# EasyEDA Pro project ProDoc_cyrus.epro, board PCB2
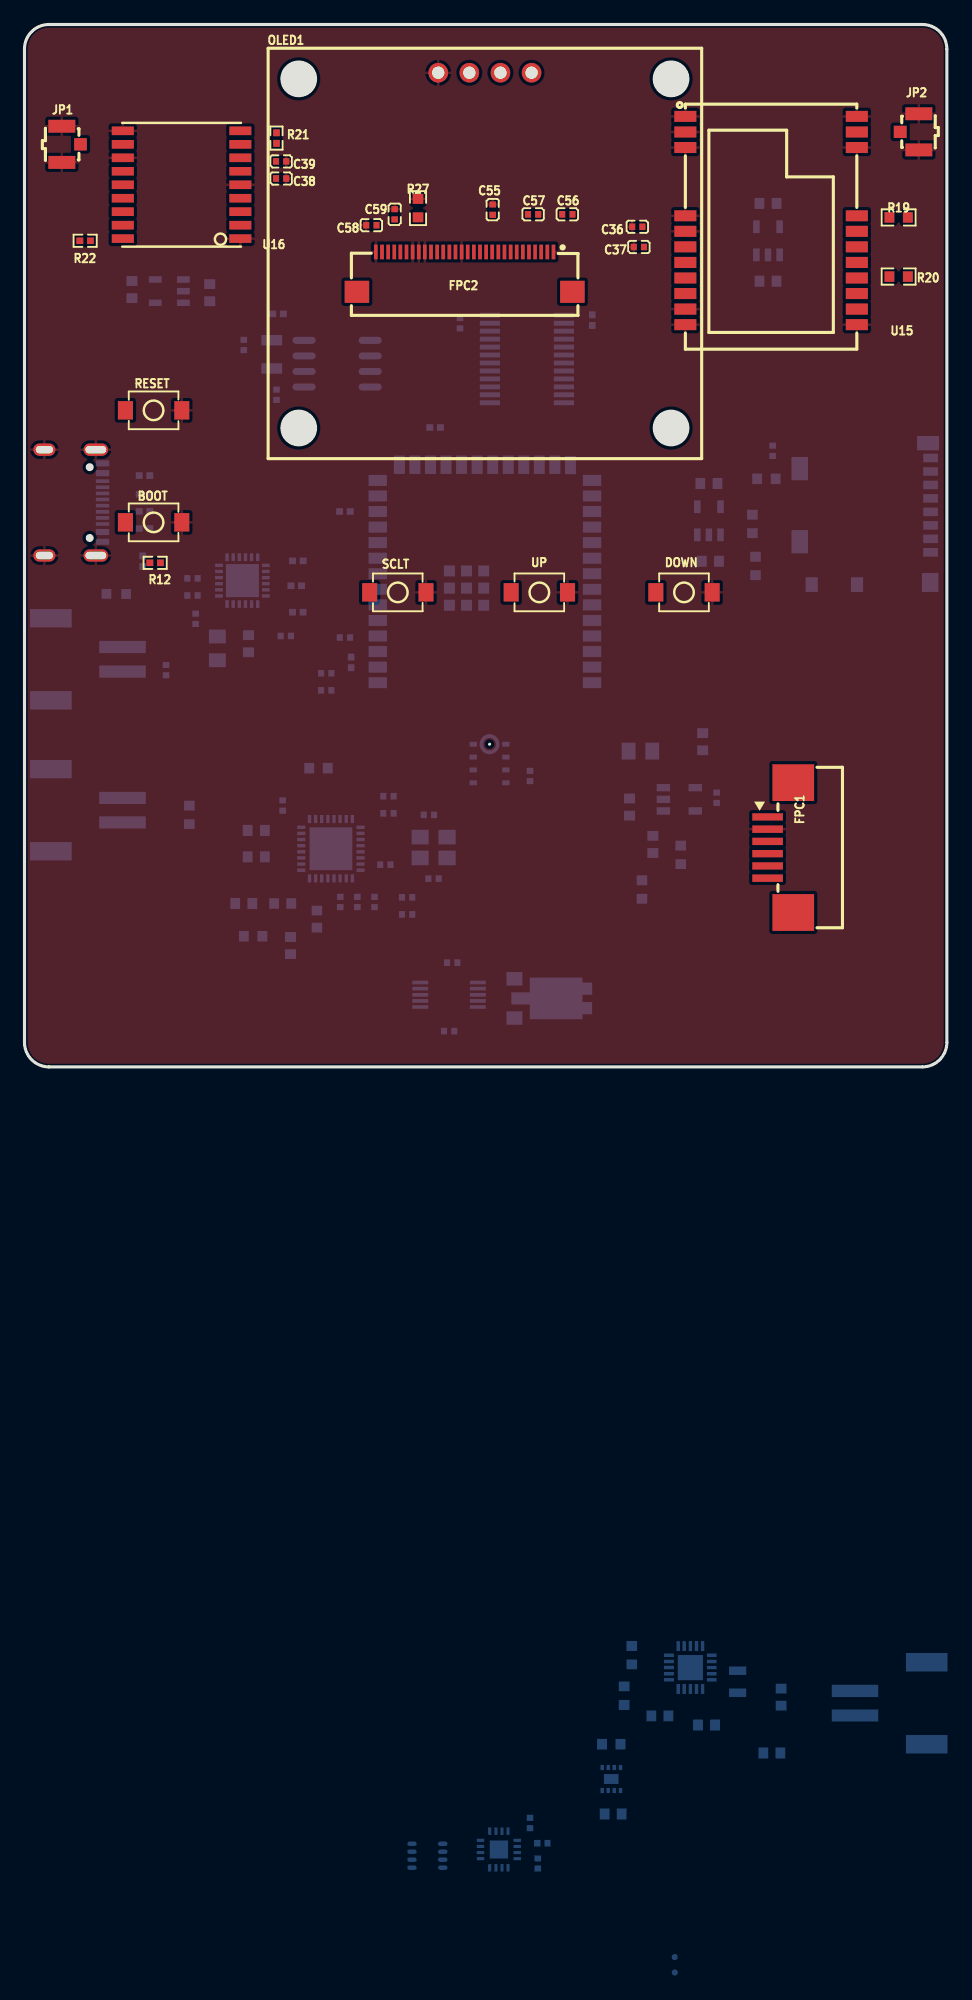
[diagram p5: board, top side]
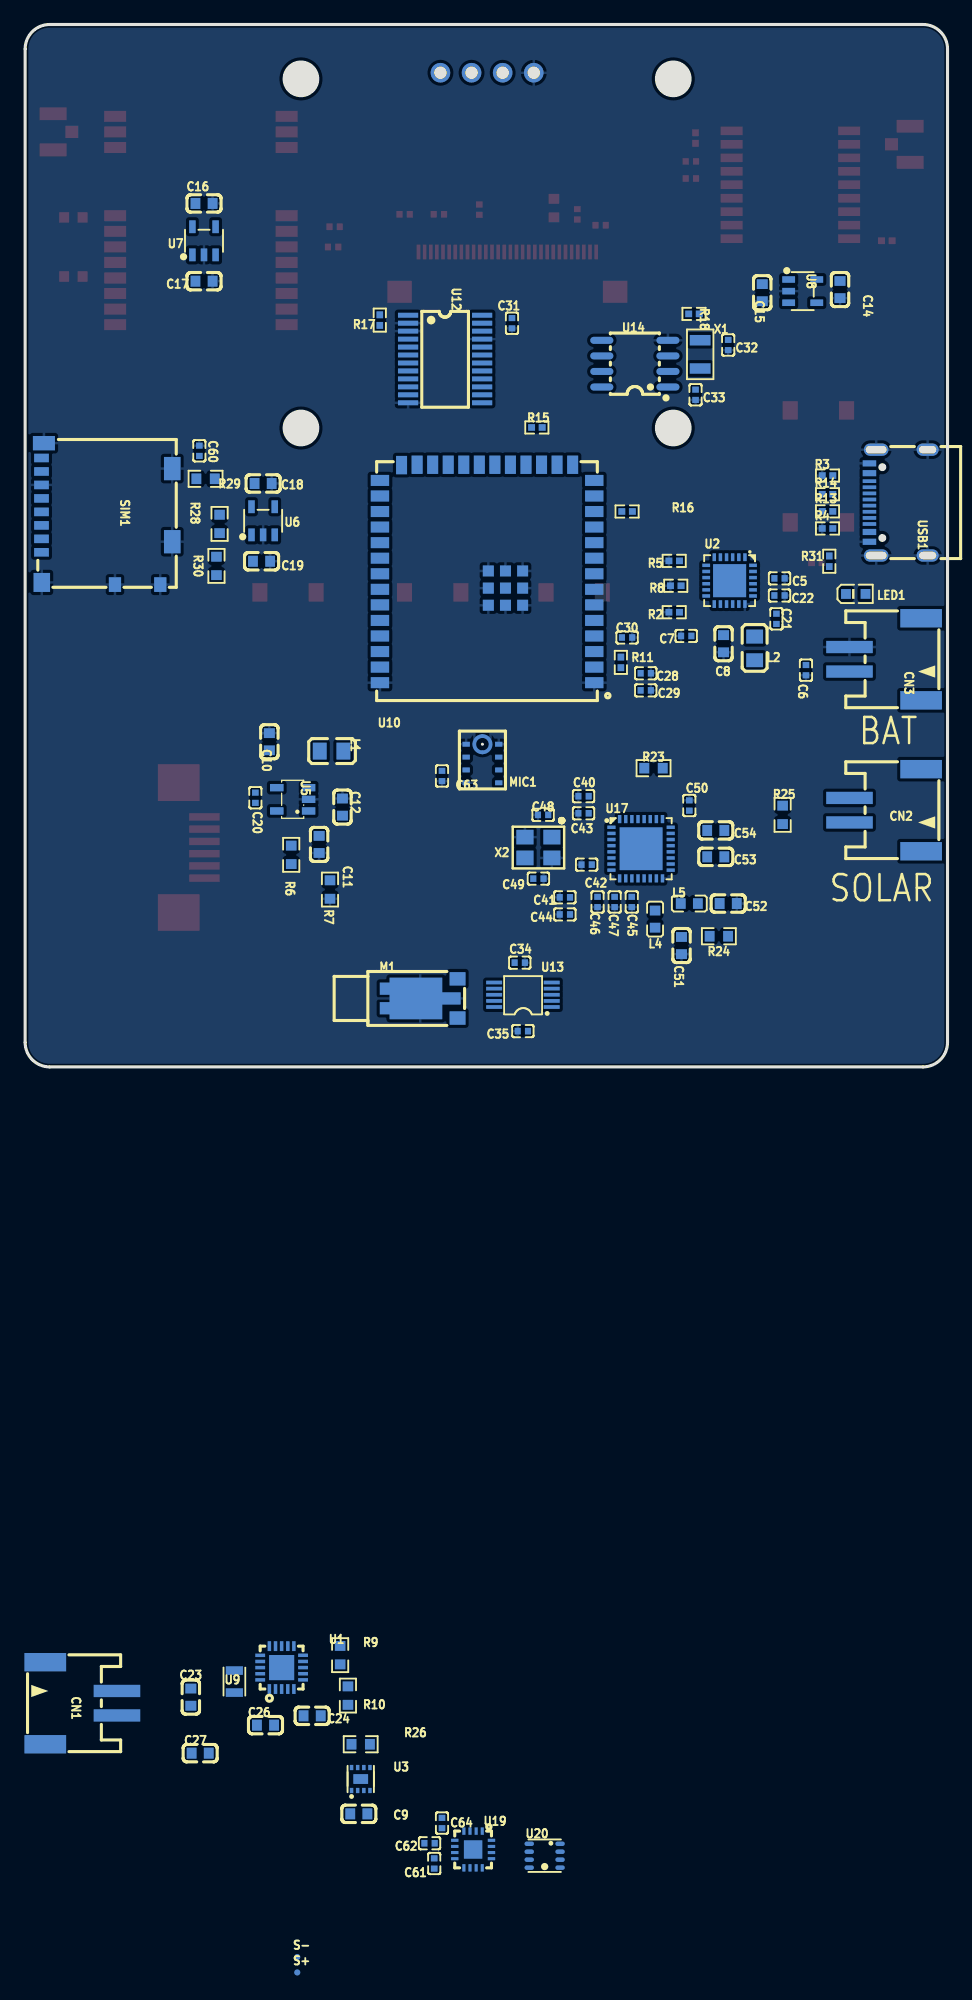
[diagram p6: board, bottom side, seen from below]

Outline 75.31 x 85.09 mm; copper layers: Top Layer, GND, VDD3V3, Bottom Layer. Coordinates in mm from the lower left corner of the outline.
Outline path: 0,83.09 0,2 arc(0.59,0.59) 2,0 73.31,0 arc(74.73,0.59) 75.31,2 75.31,83.09 arc(74.73,84.5) 73.31,85.09 2,85.09 arc(0.59,84.5) 0,83.09
Stack: Top Layer 0.035mm Outer layer thickness 1oz / Dielectric1 0.2104mm 7628 RC49% 8.6mil / GND 0.0152mm Inner layer thickness / Dielectric2 1.065mm 1.1mm H/HOZ Copper / VDD3V3 0.0152mm Inner layer thickness / Dielectric3 0.2104mm 7628 RC49% 8.6mil / Bottom Layer 0.035mm Outer layer thickness 1oz

## Design rules (mm)
net USB_DN: DP1
net USB_DP: DP1
template: JLCPCB Capability(Two Layers Board)
spacing copperThickness1oz (default): track to track 0.102, other pairs 0.152 to 0.3
spacing copperThickness2oz: track to track 0.203, other pairs 0.152 to 0.3
track width copperThickness1oz (default): min 0.127, default 0.254, max 2.54
track width copperThickness2oz: min 0.203, default 0.254, max 2.54
differential pair differentialPair (default): width min 0.127, default 0.254, max 2.54; gap min 0.152, default 0.152
via viaSize (default): diameter min 0.5, default 0.61, max 10; hole min 0.3, default 0.305, max 6.3

## Placement (name value [footprint] x y rotation side)
BOOT  TS-1088-AR02016  [SW-SMD_L3.9-W2.9-LS4.8]  10.54 44.45 0 top
C5  10uF  [C0402]  13.72 39.88 180 bottom
C6  10uF  [C0402]  11.56 32.39 270 bottom
C7  10uF  [C0402]  21.34 35.18 180 bottom
C8  22uF  [C0603]  18.29 34.54 270 bottom
C9  100nF  [C0603]  48.07 -60.97 0 bottom
C10  10uF  [C0603]  55.37 26.54 270 bottom
C11  100nF  [C0603]  51.31 18.16 90 bottom
C12  22uF  [C0603]  49.4 21.21 270 bottom
C14  10uF  [C0603]  8.78 63.45 270 bottom
C15  100nF  [C0603]  15.13 63.2 270 bottom
C16  10uF  [C0603]  60.71 70.49 180 bottom
C17  100nF  [C0603]  60.71 64.14 180 bottom
C18  10uF  [C0603]  55.88 47.63 180 bottom
C19  100nF  [C0603]  56.01 41.28 180 bottom
C20  22pF  [C0402]  56.52 21.97 90 bottom
C21  47nF  [C0402]  13.97 36.58 90 bottom
C22  10uF  [C0402]  13.72 38.48 180 bottom
C23  4.7uF  [C0603]  61.78 -51.45 90 bottom
C24  10nF  [C0603]  51.88 -52.97 0 bottom
C26  4.7uF  [C0603]  55.69 -53.73 0 bottom
C27  100nF  [C0603]  61.02 -56.02 0 bottom
C28  100nF  [C0402]  24.64 32.13 180 bottom
C29  10uF  [C0402]  24.64 30.73 180 bottom
C30  1uF  [C0402]  26.16 35.05 0 bottom
C31  100nF  [C0402]  35.56 60.71 270 bottom
C32  12pF  [C0402]  17.91 58.93 90 bottom
C33  12pF  [C0402]  20.57 54.86 90 bottom
C34  100nF  [C0402]  34.92 8.51 180 bottom
C35  1uF  [C0402]  34.67 2.92 180 bottom
C36  10uF  [C0402]  50.04 68.58 180 top
C37  100nF  [C0402]  50.17 66.93 180 top
C38  10uF  [C0402]  20.95 72.52 180 top
C39  100nF  [C0402]  20.95 73.91 0 top
C40  100nF  [C0402]  29.72 22.1 180 bottom
C41  100nF  [C0402]  31.24 13.84 180 bottom
C42  100nF  [C0402]  29.46 16.51 180 bottom
C43  100nF  [C0402]  29.72 20.7 180 bottom
C44  100nF  [C0402]  31.24 12.45 180 bottom
C45  100nF  [C0402]  25.78 13.46 90 bottom
C46  100nF  [C0402]  28.58 13.46 90 bottom
C47  100nF  [C0402]  27.18 13.46 90 bottom
C48  10pF  [C0402]  33.02 20.57 0 bottom
C49  10pF  [C0402]  33.4 15.37 0 bottom
C50  1uF  [C0402]  21.08 21.34 90 bottom
C51  100pF  [C0603]  21.72 9.91 270 bottom
C52  100pF  [C0603]  17.91 13.34 180 bottom
C53  1nF  [C0603]  18.92 17.15 0 bottom
C54  1nF  [C0603]  18.92 19.3 0 bottom
C55  100nF  [C0402]  38.23 69.98 270 top
C56  1uF  [C0402]  44.32 69.6 0 top
C57  1uF  [C0402]  41.53 69.6 0 top
C58  4.7uF  [C0402]  28.32 68.71 0 top
C59  4.7uF  [C0402]  30.23 69.6 270 top
C60  100nF  [C0402]  61.09 50.29 270 bottom
C61  10uF  [C0402]  41.91 -65.02 90 bottom
C62  100nF  [C0402]  42.29 -63.37 180 bottom
C63  100nF  [C0402]  41.27 23.75 270 bottom
C64  100nF  [C0402]  41.27 -61.72 270 bottom
CN1  S2B-PH-SM4-TB(LF)(SN)  [CONN-SMD_P2.00_S2B-PH-SM4-TB-LF-SN]  70.74 -51.94 270 bottom
CN2  S2B-PH-SM4-TB(LF)(SN)  [CONN-SMD_P2.00_S2B-PH-SM4-TB-LF-SN]  5.08 20.96 90 bottom
CN3  S2B-PH-SM4-TB(LF)(SN)  [CONN-SMD_P2.00_S2B-PH-SM4-TB-LF-SN]  5.08 33.27 90 bottom
DOWN  TS-1088-AR02016  [SW-SMD_L3.9-W2.9-LS4.8]  53.85 38.74 0 top
FPC1  FPC1.0-WSS11-6P211-H25  [FPC-SMD_FPC1.0-WSS11-6P211-H25]  61.72 17.91 90 top
FPC2  FPC-05FB-30PH20  [FPC-SMD_30P-P0.50_FPC-05FB-30PH20]  35.94 64.9 0 top
JP1  6GHz  [RF-SMD_FRF05002-JSS103M]  3.81 75.31 90 top
JP2  6GHz  [RF-SMD_FRF05002-JSS103M]  72.26 76.33 270 top
L1  2.2uH  [L0805]  50.29 25.78 0 bottom
L2  1uH  [L0805]  15.75 34.16 270 bottom
L4  470nH  [L0603]  23.88 12.06 270 bottom
L5  470nH  [L0603]  21.08 13.34 180 bottom
LED1  -  [LED0603-RD_GREEN]  7.49 38.61 180 bottom
M1  Z3OC1T8219731  [VIBRATING-MOTOR-SMD_3P-C9900001680]  41.53 5.59 180 bottom
MIC1  INMP441  [MIC-SMD_INMP441]  37.97 24.77 0 bottom
OLED1  HS13L03W2C01  [OLED-TH_L35.4-W33.5_HS13L03W2C01]  37.59 81.15 0 top
R2  NTCG104BH103HT1  [R0402]  22.32 37.12 0 bottom
R3  5.1kΩ  [R0402]  9.8 48.27 0 bottom
R4  5.1kΩ  [R0402]  9.8 43.95 0 bottom
R5  10kΩ  [R0402]  22.32 41.31 180 bottom
R6  100kΩ  [R0603]  53.59 17.31 270 bottom
R7  22.1kΩ  [R0603]  50.42 14.48 270 bottom
R8  200Ω  [R0402]  22.19 39.28 0 bottom
R9  10MΩ  [R0603]  49.59 -48.02 90 bottom
R10  7.5MΩ  [R0603]  48.96 -51.32 90 bottom
R11  10kΩ  [R0402]  26.67 33.02 270 bottom
R12  10kΩ  [R0402]  10.67 41.15 180 top
R13  22Ω  [R0402]  9.8 45.35 0 bottom
R14  22Ω  [R0402]  9.8 46.75 0 bottom
R15  4.7kΩ  [R0402]  33.53 52.2 0 bottom
R16  4.7kΩ  [R0402]  26.16 45.34 180 bottom
R17  10kΩ  [R0402]  46.36 60.96 90 bottom
R18  10kΩ  [R0402]  20.7 61.47 0 bottom
R19  10kΩ  [R0603]  71.37 69.34 180 top
R20  10kΩ  [R0603]  71.37 64.52 0 top
R21  10kΩ  [R0402]  20.57 75.82 90 top
R22  10kΩ  [R0402]  4.95 67.44 180 top
R23  10kΩ  [R0603]  24 24.38 0 bottom
R24  10kΩ  [R0603]  18.67 10.67 180 bottom
R25  10kΩ  [R0603]  13.46 20.57 90 bottom
R26  10kΩ  [R0603]  47.91 -55.29 180 bottom
R27  560kΩ  [R0603]  32.13 70.1 270 top
R28  10kΩ  [R0603]  59.44 44.32 90 bottom
R29  10kΩ  [R0603]  60.58 48.01 0 bottom
R30  10kΩ  [R0603]  59.69 40.89 270 bottom
R31  1kΩ  [R0402]  9.65 41.28 270 bottom
RESET  TS-1088-AR02016  [SW-SMD_L3.9-W2.9-LS4.8]  10.54 53.59 180 top
S+  -  [Test-Point-0.5mm]  53.09 -73.92 0 bottom
S-  -  [Test-Point-0.5mm]  53.09 -72.66 0 bottom
SCLT  TS-1088-AR02016  [SW-SMD_L3.9-W2.9-LS4.8]  30.48 38.74 0 top
SIM1  1040310811  [SIM-SMD_8P-1040310811]  68.64 45.14 270 bottom
U1  BQ25570RGRR  [VQFN-20_L3.5-W3.5-P0.50-BL-EP2.0]  54.37 -49.03 180 bottom
U2  BQ25896RTWR  [QFN-24_L4.0-W4.0-P0.50-TL-EP2.7]  17.79 39.69 270 bottom
U3  MAX17048G+T10  [TDFN-8_L2.0-W2.0-P0.50-BL-EP1.2]  47.91 -58.13 180 bottom
U5  SY8089AAAC  [SOT-23-5_L3.0-W1.7-P0.95-LS2.8-BR]  53.47 21.84 180 bottom
U6  RT9080-33GJ5  [TSOT-23-5_L2.9-W1.6-P0.95-LS2.8-BL]  55.88 44.58 180 bottom
U7  RT9080-33GJ5  [TSOT-23-5_L2.9-W1.6-P0.95-LS2.8-BL]  60.71 67.43 180 bottom
U8  RT9080-33GJ5  [TSOT-23-5_L2.9-W1.6-P0.95-LS2.8-BL]  11.82 63.33 270 bottom
U9  22uH  [IND-SMD_L1.8-W1.3]  58.23 -50.18 90 bottom
U10  2.4GHz  [WIRELM-SMD_ESP32-S3-WROOM-1U]  37.59 40.26 0 bottom
U12  XL9555  [TSSOP-24_L7.8-W4.4-P0.65-LS6.4-BL]  41.02 57.79 270 bottom
U13  -  [DRV2605LDGSR]  34.8 5.72 90 bottom
U14  PCF85063AT/A  [SO-8_L4.9-W3.9-P1.27-LS5.9-BL]  25.53 57.4 90 bottom
U15  E22-900M22S  [WIRELM-SMD_E22-900M22S]  60.96 69.09 180 top
U16  MAX-M10S-00B  [SMD-18_L10.1-W9.7-P1.10-TL_SKG09F]  12.83 72.01 180 top
U17  ST25R3916-AQWT  [VFQFPN-32_L5.0-W5.0-P0.50-TL-EP3.5]  25.02 17.81 180 bottom
U19  MAX98357AETE+T  [TQFN-16_L3.0-W3.0-P0.50-BL-EP1.5]  38.73 -63.88 0 bottom
U20  BME280  [LGA-8_BME280_BL]  32.89 -64.39 180 bottom
UP  TS-1088-AR02016  [SW-SMD_L3.9-W2.9-LS4.8]  42.04 38.74 0 top
USB1  HX TYPE-C-3.1-16PIN  [TYPE-C-SMD_HX-TYPE-C-16PIN]  4 46.07 90 bottom
X1  32.768kHz  [OSC-SMD_L3.2-W1.5]  20.19 58.17 270 bottom
X2  27.12MHz  [CRYSTAL-SMD_4P-L3.2-W2.5-BL_SIT8008BI]  33.4 17.91 0 bottom

## Footprints (pads in the part's own frame, mm; a bottom-side part is the same pattern mirrored in y, then rotated)
C0402
  rect 0.5x0.54 smd: 1(-0.42,0) 2(0.42,0)
C0603
  rect 0.8x0.9 smd: 1(-0.7,0) 2(0.7,0)
CONN-SMD_P2.00_S2B-PH-SM4-TB-LF-SN
  rect 1x3.8 smd: 1(-1,2.925) 2(1,2.925)
  rect 1.5x3.4 smd: 3(3.35,-2.925) 4(-3.35,-2.925)
CRYSTAL-SMD_4P-L3.2-W2.5-BL_SIT8008BI
  rect 1.4x1.2 smd: 1(-1.1,-0.85) 2(1.1,-0.85) 3(1.1,0.85) 4(-1.1,0.85)
DRV2605LDGSR
  rect 0.3x1.3 smd: 1(-0.827,-2.481) 2(-0.327,-2.481) 3(0.173,-2.481) 4(0.673,-2.481) 5(1.173,-2.481) 6(1.173,2.219) 7(0.673,2.219) 8(0.173,2.219) 9(-0.327,2.219) 10(-0.827,2.219)
FPC-SMD_30P-P0.50_FPC-05FB-30PH20
  rect 0.3x1.2 smd: 1(7.25,1.625) 2(6.75,1.625) 3(6.25,1.625) 4(5.75,1.625) 5(5.25,1.625) 6(4.75,1.625) 7(4.25,1.625) 8(3.75,1.625) 9(3.25,1.625) 10(2.75,1.625) 11(2.25,1.625) 12(1.75,1.625) 13(1.25,1.625) 14(0.75,1.625) 15(0.25,1.625) 16(-0.25,1.625) 17(-0.75,1.625) 18(-1.25,1.625) 19(-1.75,1.625) 20(-2.25,1.625) 21(-2.75,1.625) 22(-3.25,1.625) 23(-3.75,1.625) 24(-4.25,1.625) 25(-4.75,1.625) 26(-5.25,1.625) 27(-5.75,1.625) 28(-6.25,1.625) 29(-6.75,1.625) 30(-7.25,1.625)
  rect 2x1.8 smd: 31(-8.8,-1.625) 32(8.8,-1.625)
FPC-SMD_FPC1.0-WSS11-6P211-H25
  rect 0.6x2.5 smd: 1(2.5,1.05) 2(1.5,1.05) 3(0.5,1.05) 4(-0.5,1.05) 5(-1.5,1.05) 6(-2.5,1.05)
  rect 3x3.4 smd: 7(-5.3,-1.05) 8(5.3,-1.05)
IND-SMD_L1.8-W1.3
  rect 0.7x1.4 smd: 1(-0.9,0) 2(0.9,0)
L0603
  rect 0.8x0.864 smd: 1(-0.7,0) 2(0.7,0)
L0805
  rect 1.133x1.377 smd: 1(-0.966,0) 2(0.966,0)
LED0603-RD_GREEN
  rect 0.8x0.8 smd: 1(-0.799,-0.004) 2(0.799,0.004)
LGA-8_BME280_BL
  oval 0.767x0.364 smd: 1(1.258,0.975) 2(1.258,0.325) 3(1.258,-0.325) 4(1.258,-0.975) 5(-1.258,-0.975) 6(-1.258,-0.325) 7(-1.258,0.325) 8(-1.258,0.975)
MIC-SMD_INMP441
  rect 0.6x0.4 smd: 1(-1.33,1.575) 2(-1.33,0.525) 3(-1.33,-0.525) 4(-1.33,-1.575) 6(1.33,-1.575) 7(1.33,-0.525) 8(1.33,0.525) 9(1.33,1.575)
  custom 0.966x1.626 smd: 5(-0.661,-1.575)
  custom 0.963x1.626 smd: 5(0.664,-1.575)
OLED-TH_L35.4-W33.5_HS13L03W2C01
  round 1.6 hole 1: 1(-3.81,0) 2(-1.27,0) 3(1.27,0) 4(3.81,0)
OSC-SMD_L3.2-W1.5
  rect 0.85x1.7 smd: 1(-1.155,0) 2(1.155,0)
QFN-24_L4.0-W4.0-P0.50-TL-EP2.7
  rect 0.633x0.28 smd: 1(-1.911,1.25) 2(-1.911,0.75) 3(-1.911,0.25) 4(-1.911,-0.25) 5(-1.911,-0.75) 6(-1.911,-1.25) 13(1.911,-1.25) 14(1.911,-0.75) 15(1.911,-0.25) 16(1.911,0.25) 17(1.911,0.75) 18(1.911,1.25)
  rect 0.28x0.633 smd: 7(-1.25,-1.911) 8(-0.75,-1.911) 9(-0.25,-1.911) 10(0.25,-1.911) 11(0.75,-1.911) 12(1.25,-1.911) 19(1.25,1.911) 20(0.75,1.911) 21(0.25,1.911) 22(-0.25,1.911) 23(-0.75,1.911) 24(-1.25,1.911)
  rect 2.7x2.7 smd: 25(0,0)
R0402
  rect 0.566x0.54 smd: 1(-0.433,0) 2(0.433,0)
R0603
  rect 0.806x0.864 smd: 1(-0.753,0) 2(0.753,0)
RF-SMD_FRF05002-JSS103M
  rect 1x1.05 smd: 1(0,-0.762)
  rect 1.05x2.2 smd: 2(-1.475,0.762) 3(1.475,0.762)
SIM-SMD_8P-1040310811
  rect 0.7x1.2 smd: 1(3.138,-5.338) 2(2.038,-5.338) 3(0.938,-5.338) 4(-0.163,-5.338) 5(-1.262,-5.338) 6(-2.362,-5.338) 7(-3.462,-5.338) 8(-4.562,-5.338)
  rect 1.17x1.8 smd: 9(-5.772,-5.138)
  rect 1.55x1.35 smd: 10(5.598,-5.312)
  rect 1.2x1 smd: 11(5.772,0.662) 12(5.772,4.362)
  rect 1.9x1.35 smd: 13(2.272,5.338) 14(-3.697,5.338)
SMD-18_L10.1-W9.7-P1.10-TL_SKG09F
  rect 1.8x0.7 smd: 1(-4.8,4.4) 2(-4.8,3.3) 3(-4.8,2.2) 4(-4.8,1.1) 5(-4.8,0) 6(-4.8,-1.1) 7(-4.8,-2.2) 8(-4.8,-3.3) 9(-4.8,-4.4) 10(4.8,-4.4) 11(4.8,-3.3) 12(4.8,-2.2) 13(4.8,-1.1) 14(4.8,0) 15(4.8,1.1) 16(4.8,2.2) 17(4.8,3.3) 18(4.8,4.4)
SO-8_L4.9-W3.9-P1.27-LS5.9-BL
  oval 0.574x1.888 smd: 1(-1.905,-2.699) 2(-0.635,-2.699) 3(0.635,-2.699) 4(1.905,-2.699) 5(1.905,2.699) 6(0.635,2.699) 7(-0.635,2.699) 8(-1.905,2.699)
SOT-23-5_L3.0-W1.7-P0.95-LS2.8-BR
  rect 1.1x0.6 smd: 1(1.3,-0.95) 2(1.3,0) 3(1.3,0.95) 4(-1.3,0.95) 5(-1.3,-0.95)
SW-SMD_L3.9-W2.9-LS4.8
  rect 1.23x1.5 smd: 1(-2.3,0) 2(2.3,0)
TDFN-8_L2.0-W2.0-P0.50-BL-EP1.2
  rect 0.28x0.425 smd: 1(-0.75,-0.938) 2(-0.25,-0.938) 3(0.25,-0.938) 4(0.75,-0.938) 5(0.75,0.938) 6(0.25,0.938) 7(-0.25,0.938) 8(-0.75,0.938)
  rect 1.2x0.8 smd: 9(0,0)
Test-Point-0.5mm
  round 0.5 smd: 1(0,0)
TQFN-16_L3.0-W3.0-P0.50-BL-EP1.5
  rect 0.25x0.6 smd: 1(-0.749,-1.5) 2(-0.248,-1.5) 3(0.252,-1.5) 4(0.751,-1.5) 9(0.75,1.5) 10(0.25,1.5) 11(-0.25,1.5) 12(-0.749,1.5)
  rect 0.6x0.25 smd: 5(1.5,-0.748) 6(1.5,-0.248) 7(1.5,0.252) 8(1.5,0.752) 13(-1.5,0.752) 14(-1.5,0.252) 15(-1.5,-0.248) 16(-1.5,-0.748)
  rect 1.5x1.5 smd: 17(0,0)
TSOT-23-5_L2.9-W1.6-P0.95-LS2.8-BL
  rect 0.532x1.045 smd: 1(-0.95,-1.147) 2(0,-1.147) 3(0.95,-1.147) 4(0.95,1.147) 5(-0.95,1.147)
TSSOP-24_L7.8-W4.4-P0.65-LS6.4-BL
  rect 0.4x1.65 smd: 1(-3.575,-3.022) 2(-2.925,-3.022) 3(-2.275,-3.022) 4(-1.625,-3.022) 5(-0.975,-3.022) 6(-0.325,-3.022) 7(0.325,-3.022) 8(0.975,-3.022) 9(1.625,-3.022) 10(2.275,-3.022) 11(2.925,-3.022) 12(3.575,-3.022) 13(3.575,3.022) 14(2.925,3.022) 15(2.275,3.022) 16(1.625,3.022) 17(0.975,3.022) 18(0.325,3.022) 19(-0.325,3.022) 20(-0.975,3.022) 21(-1.625,3.022) 22(-2.275,3.022) 23(-2.925,3.022) 24(-3.575,3.022)
TYPE-C-SMD_HX-TYPE-C-16PIN
  oval 1x2 hole 0.6x1.7: 17(-4.32,1.825) 20(4.32,1.825)
  oval 1x1.8 hole 0.6x1.4: 18(-4.32,-2.376) 19(4.32,-2.376)
  rect 0.3x1.1 smd: A5(-1.25,2.374) A6(-0.25,2.374) A7(0.25,2.374) A8(1.25,2.376) B5(1.75,2.374) B6(0.75,2.374) B7(-0.75,2.374) B8(-1.75,2.376)
  rect 0.5x1.1 smd: A9B4(2.4,2.375) A12B1(3.2,2.375) B9A4(-2.4,2.375) B12A1(-3.2,2.375)
VFQFPN-32_L5.0-W5.0-P0.50-TL-EP3.5
  rect 0.665x0.28 smd: 1(-2.42,1.75) 2(-2.42,1.25) 3(-2.42,0.75) 4(-2.42,0.25) 5(-2.42,-0.25) 6(-2.42,-0.75) 7(-2.42,-1.25) 8(-2.42,-1.75) 17(2.42,-1.75) 18(2.42,-1.25) 19(2.42,-0.75) 20(2.42,-0.25) 21(2.42,0.249) 22(2.42,0.75) 23(2.42,1.25) 24(2.42,1.75)
  rect 0.28x0.665 smd: 9(-1.75,-2.42) 10(-1.25,-2.42) 11(-0.75,-2.42) 12(-0.249,-2.42) 13(0.251,-2.42) 14(0.75,-2.42) 15(1.25,-2.42) 16(1.75,-2.42) 25(1.75,2.42) 26(1.25,2.42) 27(0.75,2.42) 28(0.251,2.42) 29(-0.249,2.42) 30(-0.75,2.42) 31(-1.25,2.42) 32(-1.75,2.42)
  rect 3.5x3.5 smd: 33(0,0)
VIBRATING-MOTOR-SMD_3P-C9900001680
  rect 1.3x1.1 smd: 1(1.525,1.6) 2(1.525,-1.6)
  custom 6.6x3.4 smd: 3(-1.525,0)
VQFN-20_L3.5-W3.5-P0.50-BL-EP2.0
  rect 0.28x0.8 smd: 1(-1.001,-1.751) 2(-0.501,-1.751) 3(-0.001,-1.751) 4(0.499,-1.751) 5(1,-1.749) 11(0.999,1.749) 12(0.501,1.751) 13(-0.001,1.749) 14(-0.501,1.749) 15(-1.001,1.749)
  rect 0.8x0.28 smd: 6(1.75,-0.999) 7(1.75,-0.499) 8(1.75,0.001) 9(1.75,0.501) 10(1.75,1.001) 16(-1.75,0.999) 17(-1.75,0.499) 18(-1.75,-0.001) 19(-1.75,-0.501) 20(-1.75,-1.001)
  rect 2.05x2.05 smd: 21(-0.001,-0.001)
WIRELM-SMD_E22-900M22S
  rect 1.8x0.9 smd: 1(7,-8.5) 2(7,-7.23) 3(7,-5.96) 4(7,-0.39) 5(7,0.88) 6(7,2.15) 7(7,3.42) 8(7,4.69) 9(7,5.96) 10(7,7.23) 11(7,8.5) 12(-7,8.5) 13(-7,7.23) 14(-7,5.96) 15(-7,4.69) 16(-7,3.42) 17(-7,2.15) 18(-7,0.88) 19(-7,-0.39) 20(-7,-5.96) 21(-7,-7.23) 22(-7,-8.5)
WIRELM-SMD_ESP32-S3-WROOM-1U
  rect 1.5x0.9 smd: 1(-8.75,8.895) 2(-8.75,7.625) 3(-8.75,6.355) 4(-8.75,5.085) 5(-8.75,3.815) 6(-8.75,2.545) 7(-8.75,1.275) 8(-8.75,0.005) 9(-8.75,-1.265) 10(-8.75,-2.535) 11(-8.75,-3.805) 12(-8.75,-5.075) 13(-8.75,-6.345) 14(-8.75,-7.615) 27(8.75,-7.615) 28(8.75,-6.345) 29(8.75,-5.075) 30(8.75,-3.805) 31(8.75,-2.535) 32(8.75,-1.265) 33(8.75,0.005) 34(8.75,1.275) 35(8.75,2.545) 36(8.75,3.815) 37(8.75,5.085) 38(8.75,6.355) 39(8.75,7.625) 40(8.75,8.895)
  rect 0.9x1.5 smd: 15(-6.985,-8.895) 16(-5.715,-8.895) 17(-4.445,-8.895) 18(-3.175,-8.895) 19(-1.905,-8.895) 20(-0.635,-8.895) 21(0.635,-8.895) 22(1.905,-8.895) 23(3.175,-8.895) 24(4.445,-8.895) 25(5.715,-8.895) 26(6.985,-8.865)
  rect 0.9x0.9 smd: 41(-2.9,-0.225) 41(-2.9,1.175) 41(-2.9,2.575) 41(-1.5,-0.225) 41(-1.5,1.175) 41(-1.5,2.575) 41(-0.1,-0.225) 41(-0.1,1.175) 41(-0.1,2.575)

## Nets
As in the schematic, except:
$4N2173: JP1.1 U16.11

Pads without a net: CN1 3 4; CN2 3 4; CN3 3 4; FPC1 7 8; FPC2 7 31 32; SIM1 1 8; U1 13 14 16; U2 3 7 8 12 24; U3 1; U6 4; U7 4; U8 4; U10 15 25 26 33 36 37; U12 11 13 14 15 16 17 18 19 20; U14 7; U15 8; U16 13 15 16 17; U17 2 17 18 19 25 28; U19 5 6 12 13; USB1 A8 B8

## Copper pours and planes (outline as drawn; the poured copper is in the pictures)
GND on Top Layer: -1.78,85.47 76.2,85.47 76.2,-0.89 -1.78,-0.89
GND on Bottom Layer: -2.41,85.73 76.2,85.73 76.2,-2.54 -2.41,-2.54
GND on GND: -1.02,85.98 76.96,85.98 76.96,-1.4 -1.02,-1.4
VBAT on VDD3V3: -0.89,85.47 76.2,85.47 76.2,-1.02 -0.89,-1.02

## Text on the board
Bottom Silkscreen Layer: BAT | SOLAR
